# Altium schematic sheet 04_Power_Diagram.SchDoc
size 297 x 209 mm
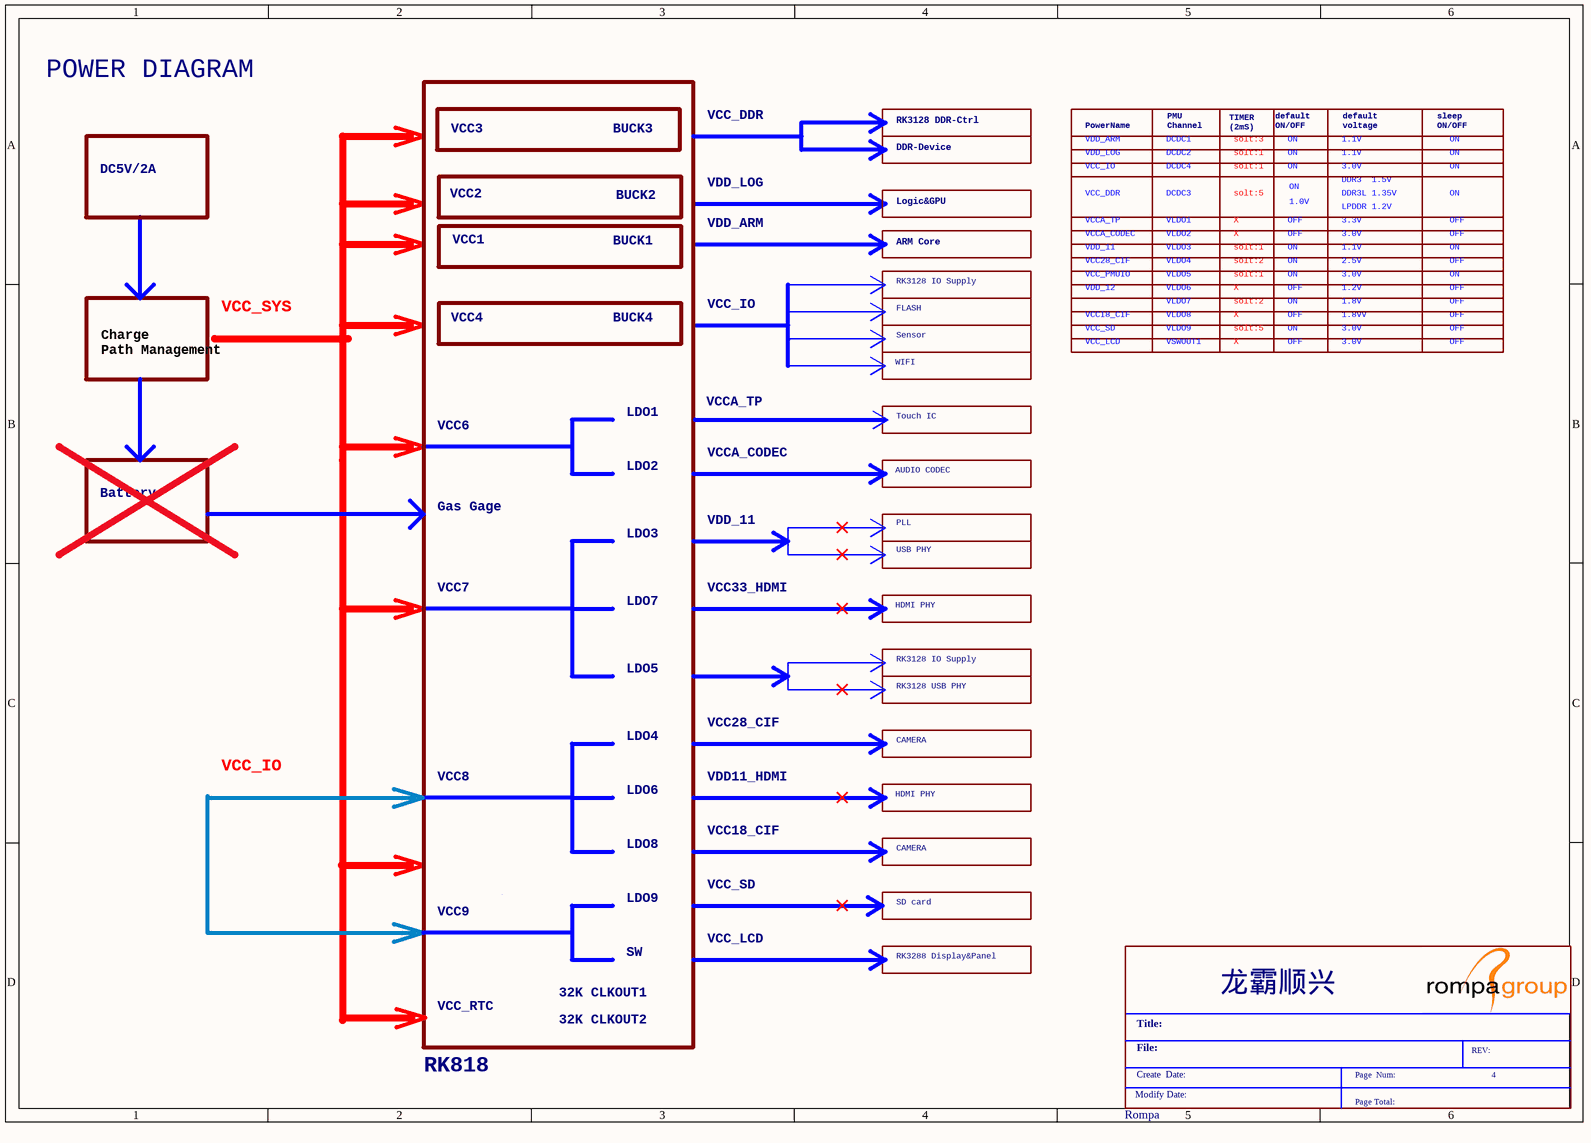
[diagram p0: 04_Power_Diagram.SchDoc]

## Parts
*  Rompa  Schematic Page Number: 4  (graphical)

## Notes on the sheet
- POWER DIAGRAM
- VCC3
- BUCK3
- VCC_DDR
- RK3128 DDR-Ctrl
- PowerName
- PMU
  Channel
- TIMER
  (2mS)
- default
  ON/OFF
- default
  voltage
- sleep
  ON/OFF
- DC5V/2A
- VCC2
- BUCK2
- VDD_LOG
- DDR-Device
- Logic&GPU
- VDD_ARM
- VCC_IO
- DCDC4
- DCDC3
- DCDC2
- DCDC1
- solt:1
- solt:5
- solt:3
- ON
- 1.0V
- 1.1V
- DDR3  1.5V
- DDR3L 1.35V
- 3.0V
- VCC1
- BUCK1
- ARM Core
- VDD_11
- VCCA_TP
- VCCA_CODEC
- VCC28_CIF
- VLDO4
- VLDO3
- VLDO2
- VLDO1
- solt:2
- X
- OFF
- 3.3V
- LPDDR 1.2V
- 2.5V
- VCC_SYS
- VCC4
- BUCK4
- RK3128 IO Supply
- FLASH
- Sensor
- VCC_SD
- VCC_PMUIO
- VCCI8_CIF
- VDD_12
- VLDO5
- VLDO9
- VLDO8
- VLDO7
- VLDO6
- 1.2V
- 1.8VV
- 1.8V
- Charge
  Path Management
- WIFI
- VCC_LCD
- VSWOUT1
- VCC6
- LDO2
- LDO1
- AUDIO CODEC
- Touch IC
- Battery
- Gas Gage
- LDO3
- PLL
- VCC7
- LDO7
- VCC33_HDMI
- HDMI PHY
- USB PHY
- LDO5
- LDO4
- RK3128 USB PHY
- CAMERA
- VCC8
- LDO6
- VDD11_HDMI
- LDO8
- VCC18_CIF
- VCC9
- LDO9
- SD card
- VCC_RTC
- 32K CLKOUT1
- SW
- RK3288 Display&Panel
- RK818
- 32K CLKOUT2
- (in symbol Rompa) 龙霸顺兴; Title:; File:; REV:; Create  Date:; Page  Num:; Modify Date:; Page Total: